# Altium schematic sheet Analog - High Speed DE.SchDoc: Analog - High Speed Differential
size B; DrawnBy: Jasper Yun; SheetNumber: 7; SheetTotal: 11; Competition: SAC 2021; Subteam: Avionics; University: McGill University; Location: Montreal, Quebec; Project: Avionics Project Name; MRT: McGill Rocket Team
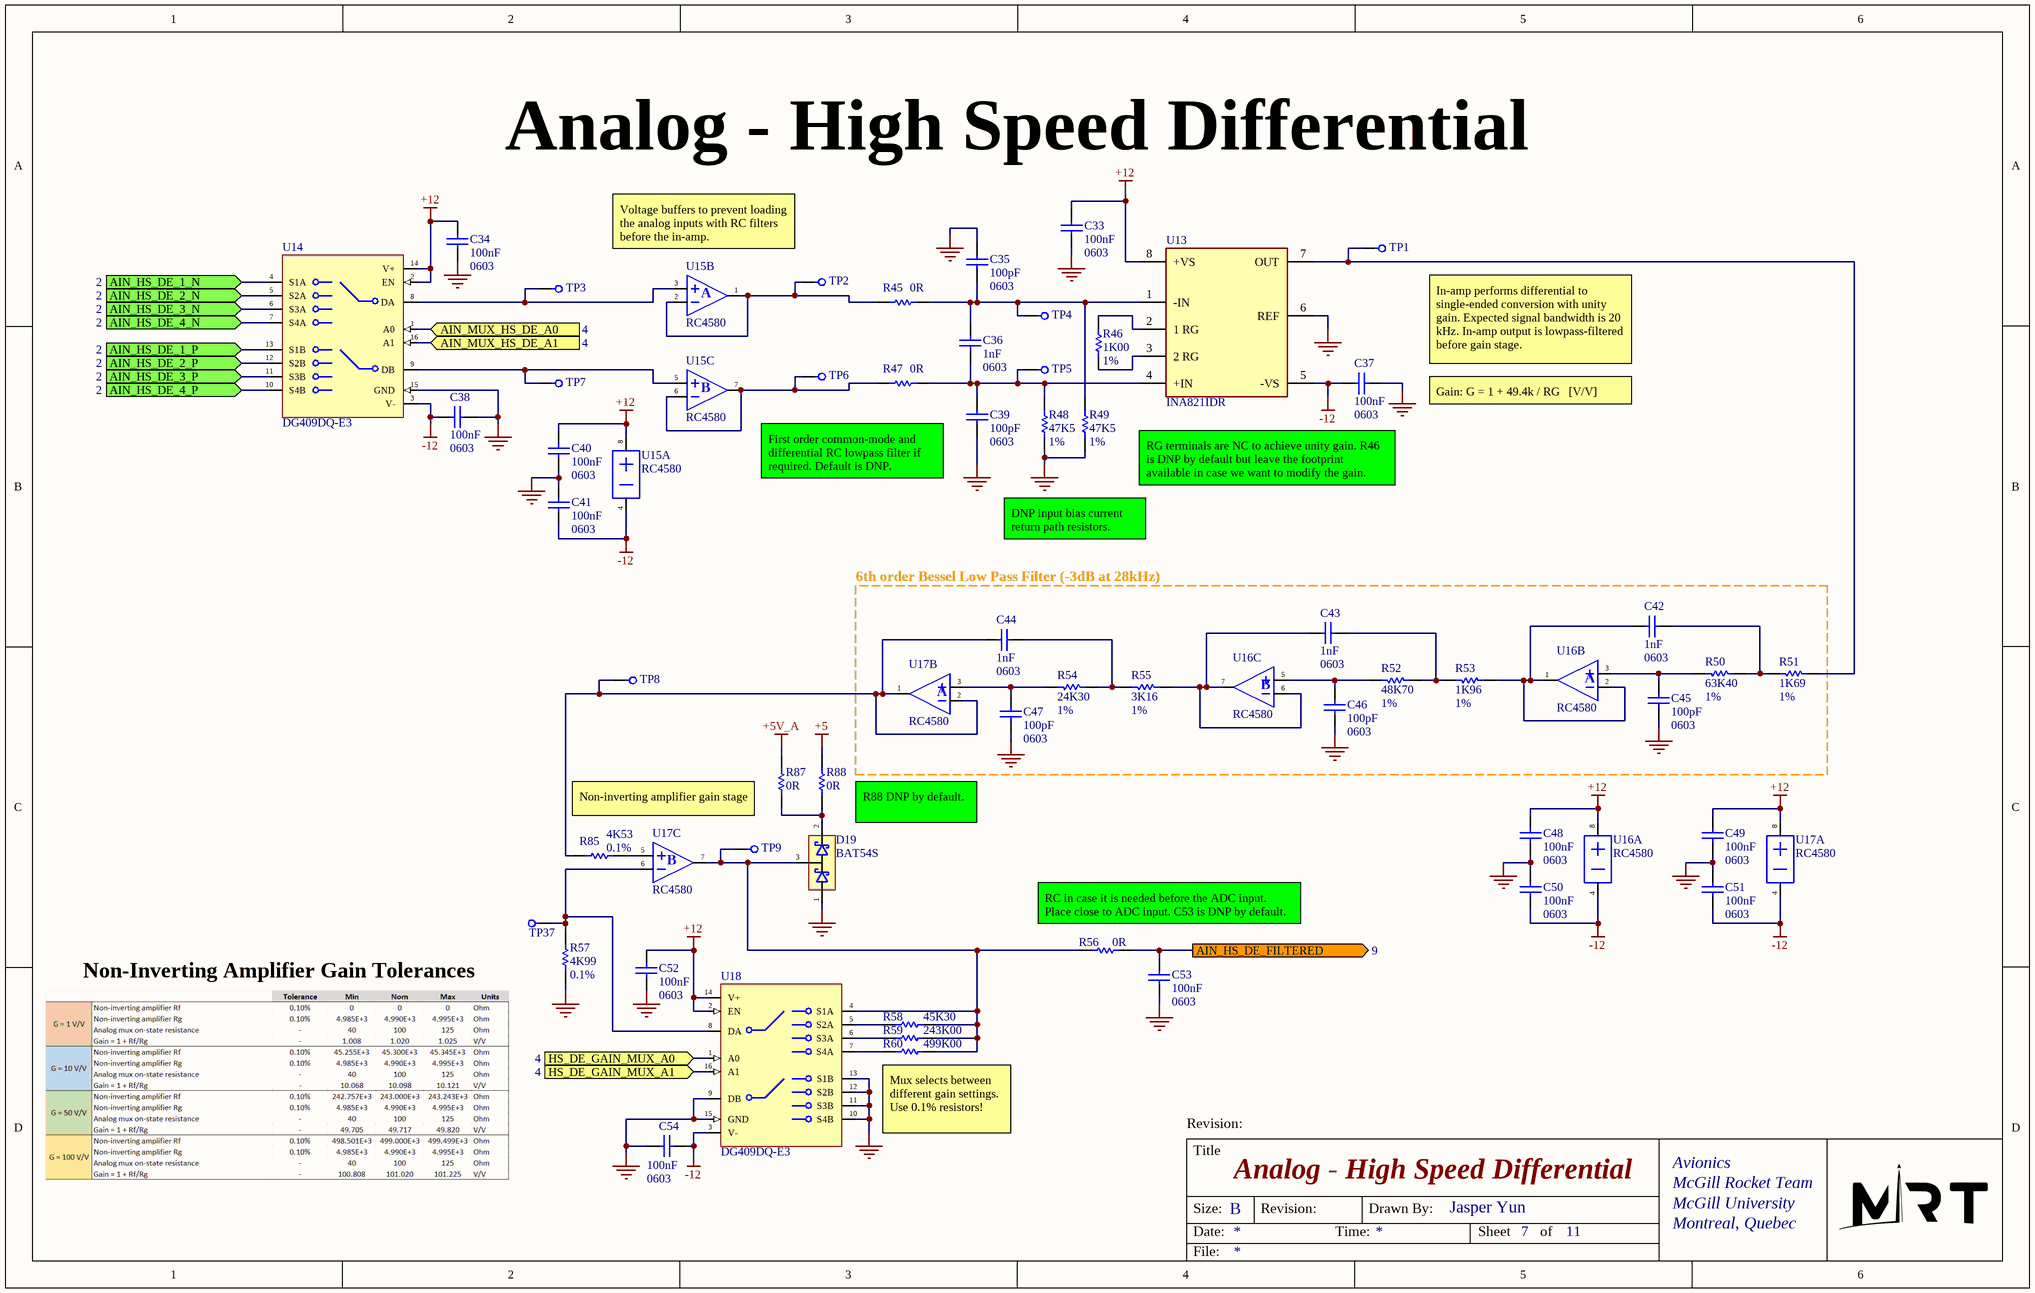
[diagram p0: Analog - High Speed DE.SchDoc]

## Parts
C33  100nF  value 0603  [0603 CAP SAMSUNG CL10C]
C34  100nF  value 0603  [0603 CAP SAMSUNG CL10C]
C35  100pF  value 0603  [0603 CAP SAMSUNG CL10C]
C36  1nF  value 0603  [0603 CAP SAMSUNG CL10C]
C37  100nF  value 0603  [0603 CAP SAMSUNG CL10C]
C38  100nF  value 0603  [0603 CAP SAMSUNG CL10C]
C39  100pF  value 0603  [0603 CAP SAMSUNG CL10C]
C40  100nF  value 0603  [0603 CAP SAMSUNG CL10C]
C41  100nF  value 0603  [0603 CAP SAMSUNG CL10C]
C42  1nF  value 0603  [0603 CAP SAMSUNG CL10C]
C43  1nF  value 0603  [0603 CAP SAMSUNG CL10C]
C44  1nF  value 0603  [0603 CAP SAMSUNG CL10C]
C45  100pF  value 0603  [0603 CAP SAMSUNG CL10C]
C46  100pF  value 0603  [0603 CAP SAMSUNG CL10C]
C47  100pF  value 0603  [0603 CAP SAMSUNG CL10C]
C48  100nF  value 0603  [0603 CAP SAMSUNG CL10C]
C49  100nF  value 0603  [0603 CAP SAMSUNG CL10C]
C50  100nF  value 0603  [0603 CAP SAMSUNG CL10C]
C51  100nF  value 0603  [0603 CAP SAMSUNG CL10C]
C52  100nF  value 0603  [0603 CAP SAMSUNG CL10C]
C53  100nF  value 0603  [0603 CAP SAMSUNG CL10C]
C54  100nF  value 0603  [0603 CAP SAMSUNG CL10C]
D19  BAT54S  [SOT23-3]
R45  0R  [0603 RES]
R46  1K00  value 1%  [0603 RES]
R47  0R  [0603 RES]
R48  47K5  value 1%  [0603 RES]
R49  47K5  value 1%  [0603 RES]
R50  63K40  value 1%  [0603 RES]
R51  1K69  value 1%  [0603 RES]
R52  48K70  value 1%  [0603 RES]
R53  1K96  value 1%  [0603 RES]
R54  24K30  value 1%  [0603 RES]
R55  3K16  value 1%  [0603 RES]
R56  0R  [0603 RES]
R57  4K99  value 0.1%  [0603 RES]
R58  45K30  [0603 RES]
R59  243K00  [0603 RES]
R60  499K00  [0603 RES]
R85  4K53  value 0.1%  [0603 RES]
R87  0R  [0603 RES]
R88  0R  [0603 RES]
TP1  Test Point  [Test Point Keystone 5015]  (value not drawn)
TP2  Test Point  [TEST POINT SMD PAD]  (value not drawn)  (no BOM)
TP3  Test Point  [TEST POINT SMD PAD]  (value not drawn)  (no BOM)
TP4  Test Point  [TEST POINT SMD PAD]  (value not drawn)  (no BOM)
TP5  Test Point  [TEST POINT SMD PAD]  (value not drawn)  (no BOM)
TP6  Test Point  [TEST POINT SMD PAD]  (value not drawn)  (no BOM)
TP7  Test Point  [TEST POINT SMD PAD]  (value not drawn)  (no BOM)
TP8  Test Point  [Test Point Keystone 5015]  (value not drawn)
TP9  Test Point  [Test Point Keystone 5015]  (value not drawn)
TP37  Test Point  [Test Point Keystone 5015]  (value not drawn)
U13  INA821IDR  [FP-D0008A-IPC_A]
U14  DG409DQ-E3  [TSSOP-16]
U15  RC4580  [SOIC-8]  (parts A,B,C of 3)
U16  RC4580  [SOIC-8]  (parts A,B,C of 3)
U17  RC4580  [SOIC-8]  (parts A,B,C of 3)
U18  DG409DQ-E3  [TSSOP-16]

## Blocks framed on the sheet
6th order Bessel Low Pass Filter (-3dB at 28kHz): C42-C47 R50-R55 U16 U17

## Ports
AIN_HS_DE_1_N (in, see 2), AIN_HS_DE_1_P (in, see 2), AIN_HS_DE_2_N (in, see 2), AIN_HS_DE_2_P (in, see 2), AIN_HS_DE_3_N (in, see 2), AIN_HS_DE_3_P (in, see 2), AIN_HS_DE_4_N (in, see 2), AIN_HS_DE_4_P (in, see 2), AIN_HS_DE_FILTERED (out, see 9), AIN_MUX_HS_DE_A0 (in, see 4), AIN_MUX_HS_DE_A1 (in, see 4), HS_DE_GAIN_MUX_A0 (in, see 4), HS_DE_GAIN_MUX_A1 (in, see 4)

## Nets
+5: R88.1
+5V_A: R87.1
+12: C33.2 C34.2 C40.2 C48.2 C49.2 C52.2 U13.8(+VS) U14.2(EN) U14.14(V+) U15.8(VCC+) U16.8(VCC+) U17.8(VCC+) U18.2(EN) U18.14(V+)
-12: C37.2 C38.2 C41.1 C50.1 C51.1 C54.2 U13.5(-VS) U14.3(V-) U15.4(VCC-) U16.4(VCC-) U17.4(VCC-) U18.3(V-)
GND: C33.1 C34.1 C35.2 C37.1 C38.1 C39.1 C40.1 C41.2 C45.1 C46.1 C47.1 C48.1 C49.1 C50.2 C51.2 C52.1 C53.1 C54.1 D19.1 R48.1 R49.1 R57.1 U13.6(REF) U14.15(GND) U18.9(DB) U18.10(S4B) U18.11(S3B) U18.12(S2B) U18.13(S1B) U18.15(GND)
AIN_HS_DE_1_N: U14.4(S1A) ; port AIN_HS_DE_1_N
AIN_HS_DE_1_P: U14.13(S1B) ; port AIN_HS_DE_1_P
AIN_HS_DE_2_N: U14.5(S2A) ; port AIN_HS_DE_2_N
AIN_HS_DE_2_P: U14.12(S2B) ; port AIN_HS_DE_2_P
AIN_HS_DE_3_N: U14.6(S3A) ; port AIN_HS_DE_3_N
AIN_HS_DE_3_P: U14.11(S3B) ; port AIN_HS_DE_3_P
AIN_HS_DE_4_N: U14.7(S4A) ; port AIN_HS_DE_4_N
AIN_HS_DE_4_P: U14.10(S4B) ; port AIN_HS_DE_4_P
AIN_HS_DE_FILTERED: C53.2 R56.1 ; port AIN_HS_DE_FILTERED
AIN_MUX_HS_DE_A0: U14.1(A0) ; port AIN_MUX_HS_DE_A0
AIN_MUX_HS_DE_A1: U14.16(A1) ; port AIN_MUX_HS_DE_A1
HS_DE_GAIN_MUX_A0: U18.1(A0) ; port HS_DE_GAIN_MUX_A0
HS_DE_GAIN_MUX_A1: U18.16(A1) ; port HS_DE_GAIN_MUX_A1
NetC35_1: C35.1 C36.2 R45.1 R49.2 TP4.1 U13.1(-IN)
NetC36_1: C36.1 C39.2 R47.1 R48.2 TP5.1 U13.4(+IN)
NetC42_1: C42.1 R53.1 U16.1 U16.2
NetC42_2: C42.2 R50.1 R51.2
NetC43_1: C43.1 R55.1 U16.6 U16.7
NetC43_2: C43.2 R52.1 R53.2
NetC44_1: C44.1 R85.2 TP8.1 U17.1 U17.2
NetC44_2: C44.2 R54.1 R55.2
NetC45_2: C45.2 R50.2 U16.3
NetC46_2: C46.2 R52.2 U16.5
NetC47_2: C47.2 R54.2 U17.3
NetD19_2: D19.2 R87.2 R88.2
NetD19_3: D19.3 R56.2 R58.1 R59.1 R60.1 TP9.1 U17.7 U18.4(S1A)
NetR45_2: R45.2 TP2.1 U15.1 U15.2
NetR46_1: R46.1 U13.3(2_RG)
NetR46_2: R46.2 U13.2(1_RG)
NetR47_2: R47.2 TP6.1 U15.6 U15.7
NetR51_1: R51.1 TP1.1 U13.7(OUT)
NetR57_2: R57.2 TP37.1 U17.6 U18.8(DA)
NetR58_2: R58.2 U18.5(S2A)
NetR59_2: R59.2 U18.6(S3A)
NetR60_2: R60.2 U18.7(S4A)
NetR85_1: R85.1 U17.5
NetTP3_1: TP3.1 U14.8(DA) U15.3
NetTP7_1: TP7.1 U14.9(DB) U15.5

## Notes on the sheet
- Voltage buffers to prevent loading the analog inputs with RC filters before the in-amp.
- In-amp performs differential to single-ended conversion with unity gain. Expected signal bandwidth is 20 kHz. In-amp output is lowpass-filtered before gain stage.
- Gain: G = 1 + 49.4k / RG   [V/V]
- First order common-mode and differential RC lowpass filter if required. Default is DNP.
- RG terminals are NC to achieve unity gain. R46 is DNP by default but leave the footprint available in case we want to modify the gain.
- DNP input bias current return path resistors.
- Non-inverting amplifier gain stage
- R88 DNP by default.
- (near R56) RC in case it is needed before the ADC input. Place close to ADC input. C53 is DNP by default.
- Non-Inverting Amplifier Gain Tolerances
- (near R60) Mux selects between different gain settings.
  Use 0.1% resistors!
- Title
- Size:
- Date:
- B
- Revision:
- Time:
- Drawn By:
- Sheet
- of
- File:
- (in symbol OP AMP RC4580, part B) A
- (in symbol OP AMP RC4580, part C) B

## Library data of the parts
C33-C54 = Cap: Capacitor; Published: 8-Jun-2000; LatestRevisionDate: 17-Jul-2002; LatestRevisionNote: Re-released for DXP Platform.; PackageReference: RAD-0.3; Publisher: Altium Limited; PackageDescription: Radial Cap, Thru-Hole; 2 Leads; 0.3 in Pin Spacing
D19 = Schottky Diode Array BAT54S: Rectifier Diode Small Signal Schottky 40V 0.3A 5ns 3-Pin SOT-23 T/R; Manufacturer: STMicroelectronics; Manufacturer Part Number: BAT54SFILM; Forward Current: 300mA; Peak Non-Repetitive Surge Current: 1A; Forward Voltage: 900mV; Max Reverse Current: 100uA; Max Reverse Leakage Current: 1uA; Element Configuration: Single; Voltage Rating (DC): 30V; Supplier 1: Digi-Key; RoHS: Yes; Category: Rectifier Diodes; Stock 1: 2760; Pricing 1: 1=0.34000, 10=0.27800, 100=0.14730, 500=0.09694, 1000=0.06592 (USD); Mount: Surface Mount; Case/Package: SOT-23; Number of Pins: 3; Weight: 0.1lb; Min Operating Temperature: -40°C; Max Operating Temperature: 150°C; Reverse Recovery Time: 5ns; Max Repetitive Reverse Voltage (Vrrm): 40V; Packaging: Tape and Reel; Package Quantity: 3000; Average Rectified Current: 300mA; Max Forward Surge Current (Ifsm): 1A; Max Reverse Voltage (DC): 40V; Max Surge Current: 1A; Recovery Time: 5ns; Termination: SMD/SMT; Current Rating: 300mA; Length: 2.9mm; Width: 3.05mm; Height: 0.95mm; Radiation Hardening: No; REACH SVHC: No SVHC; RoHS Compliant: Yes; Lead Free: Lead Free; ComponentLink1URL: https://datasheet.ciiva.com/1200/1689724-1200683.pdf?src-supplier=Farnell; ComponentLink1Description: https://datasheet.ciiva.com/1200/1689724-1200683.pdf?src-supplier=Farnell; ComponentLink2URL: https://datasheet.ciiva.com/1177/1689724-1177974.pdf?src-supplier=Element14; ComponentLink2Description: https://datasheet.ciiva.com/1177/1689724-1177974.pdf?src-supplier=Element14; ComponentLink3URL: https://datasheet.ciiva.com/1200/cd00001322-1200682.pdf?src-supplier=Farnell; ComponentLink3Description: https://datasheet.ciiva.com/1200/cd00001322-1200682.pdf?src-supplier=Farnell; ComponentLink4URL: https://datasheet.ciiva.com/14168/cd00001322-14168028.pdf?src-supplier=Distrelec; ComponentLink4Description: https://datasheet.ciiva.com/14168/cd00001322-14168028.pdf?src-supplier=Distrelec; ComponentLink5URL: https://datasheet.ciiva.com/905/cd00001322-905882.pdf?src-supplier=Digi-Key; ComponentLink5Description: https://datasheet.ciiva.com/905/cd00001322-905882.pdf?src-supplier=Digi-Key; ComponentLink6URL: https://datasheet.ciiva.com/905/cd00001322-905881.pdf?src-supplier=Digi-Key; ComponentLink6Description: https://datasheet.ciiva.com/905/cd00001322-905881.pdf?src-supplier=Digi-Key; ComponentLink7URL: https://datasheet.ciiva.com/905/cd00001322-905883.pdf?src-supplier=Digi-Key; ComponentLink7Description: https://datasheet.ciiva.com/905/cd00001322-905883.pdf?src-supplier=Digi-Key; ComponentLink8URL: https://datasheet.ciiva.com/1177/1689724-1177973.pdf?src-supplier=Element14; ComponentLink8Description: https://datasheet.ciiva.com/1177/1689724-1177973.pdf?src-supplier=Element14; Supplier Part Number 1: 497-2522-1-ND
R45 R47 R56 R58-R60 R87 R88 = Res1: Resistor; Value: 1%; Published: 8-Jun-2000; LatestRevisionDate: 17-Jul-2002; LatestRevisionNote: Re-released for DXP Platform.; PackageReference: AXIAL-0.3; Publisher: Altium Limited; PackageDescription: Axial Device, Thru-Hole; 2 Leads; 0.3 in Pin Spacing
R46 R48-R55 R57 R85 = Res1: Resistor; Published: 8-Jun-2000; LatestRevisionDate: 17-Jul-2002; LatestRevisionNote: Re-released for DXP Platform.; PackageReference: AXIAL-0.3; Publisher: Altium Limited; PackageDescription: Axial Device, Thru-Hole; 2 Leads; 0.3 in Pin Spacing
TP1-TP9 TP37 = Test Point: Keystone 5015 Test point
U13 = CMP-04895-000157-1: IC INST AMP 1 CIRCUIT 8SOIC; RoHS Compliant: Yes
U14 U18 = Analog Mux DG409DQ-E3: DG409 Series 20 V 8-Ch/Dual 4-Ch High-Performance CMOS Analog Multiplexer; Manufacturer: Vishay Siliconix; Min Supply Voltage: 13V; Max Supply Voltage: 44V; Number of Inputs: 8; Number of Outputs: 2; Number of Channels: 4; Min Dual Supply Voltage: 5V; Max Dual Supply Voltage: 20V; Propagation Delay: 160ns; On-State Resistance: 90R; Operating Supply Current: 1uA; Turn-On Delay Time: 150ns; Max Power Dissipation: 600mW; Max Supply Current: 500uA; Supply Type: Dual,Single; Dual Supply Voltage: 15V; Operating Supply Voltage: 36V; Supplier 1: Mouser; Manufacturer Part Number: DG409DQ-E3; RoHS: Yes; Category: Decoders and Multiplexers; Stock 1: 4584; Pricing 1: 1=4.36000, 10=3.91000, 50=3.70000, 100=3.20000, 1000=2.73000, 10000=2.40000 (USD); Mount: Surface Mount; Case/Package: TSSOP; Number of Pins: 16; Weight: 0.006102oz; Min Operating Temperature: -40°C; Max Operating Temperature: 85°C; Package Quantity: 360; Packaging: Rail/Tube; Logic Function: Multiplexer; Turn-Off Delay Time: 150ns; Power Dissipation: 600mW; Series: -; Length: 5.07mm; Width: 4.4mm; Height: 0.92mm; Radiation Hardening: No; Lead Free: Lead Free; RoHS Compliant: Yes; ComponentLink1URL: https://datasheet.ciiva.com/1677/dg408-1677556.pdf?src-supplier=Digi-Key; ComponentLink1Description: https://datasheet.ciiva.com/1677/dg408-1677556.pdf?src-supplier=Digi-Key; ComponentLink2URL: https://datasheet.ciiva.com/2978/dg408-2978747.pdf?src-supplier=Avnet; ComponentLink2Description: https://datasheet.ciiva.com/2978/dg408-2978747.pdf?src-supplier=Avnet; Supplier Part Number 1: 78-DG409DQ-E3
U15-U17 = OP AMP RC4580: 2-channel, 12-MHz, low-noise, low-distortion audio op amp with high output current 8-SOIC -40 to 85; Manufacturer: Texas Instruments; Manufacturer Part Number: RC4580IDR; Min Supply Voltage: 4V; Max Supply Voltage: 32V; Max Dual Supply Voltage: 16V; Min Dual Supply Voltage: 2V; Voltage Gain: 110dB; Common Mode Rejection Ratio: 80dB; Nominal Gain Bandwidth Product: 12MHz; Number of Channels: 2; Slew Rate: 5V/µs; Max I/O Voltage: 3mV; Input Bias Current: 500nA; Operating Supply Current: 6mA; Output Current per Channel: 50mA; Nominal Supply Current: 4.5mA; Dual Supply Voltage: 9V; Load Impedance: 2kR; Supplier 1: Digi-Key; RoHS: Yes; Category: Amplifiers - Op Amps, Buffer, Instrumentation; Stock 1: 3503; Pricing 1: 1=0.46000, 10=0.37400, 25=0.34200, 100=0.25460, 250=0.23072, 500=0.19092, 1000=0.14320 (USD); Case/Package: D; Number of Pins: 8; Weight: 0.002561oz; Contact Plating: Gold; Min Operating Temperature: -40°C; Max Operating Temperature: 85°C; Packaging: Tape and Reel; Package Quantity: 1; Number of Circuits: 2; Gain Bandwidth Product: 12MHz; Input Offset Voltage (Vos): 3mV; Series: -; Supply Current: 4.5mA; Bandwidth: 12MHz; Unity Gain Bandwidth Product: 12MHz; Number of Elements: 2; Technology: BIPOLAR; Radiation Hardening: No; Lead Free: Lead Free; RoHS Compliant: Yes; Reach SVHC Compliant: No SVHC; ComponentLink1URL: https://datasheet.ciiva.com/23806/1716592-23806563.pdf?src-supplier=Newark; ComponentLink1Description: https://datasheet.ciiva.com/23806/1716592-23806563.pdf?src-supplier=Newark; ComponentLink2URL: https://datasheet.ciiva.com/22654/1882301-22654837.pdf?src-supplier=Element14; ComponentLink2Description: https://datasheet.ciiva.com/22654/1882301-22654837.pdf?src-supplier=Element14; ComponentLink3URL: https://datasheet.ciiva.com/46382/1840282-46382300.pdf?src-supplier=Element14; ComponentLink3Description: https://datasheet.ciiva.com/46382/1840282-46382300.pdf?src-supplier=Element14; ComponentLink4URL: https://datasheet.ciiva.com/1796/rc4580-1796261.pdf?src-supplier=Digi-Key; ComponentLink4Description: https://datasheet.ciiva.com/1796/rc4580-1796261.pdf?src-supplier=Digi-Key; ComponentLink5URL: https://datasheet.ciiva.com/1796/rc4580-1796260.pdf?src-supplier=Digi-Key; ComponentLink5Description: https://datasheet.ciiva.com/1796/rc4580-1796260.pdf?src-supplier=Digi-Key; ComponentLink6URL: https://datasheet.ciiva.com/1796/rc4580-1796262.pdf?src-supplier=Digi-Key; ComponentLink6Description: https://datasheet.ciiva.com/1796/rc4580-1796262.pdf?src-supplier=Digi-Key; Supplier Part Number 1: 296-15367-1-ND